# EAGLE design robotic_arm_arduino_uno_shield_ece196 (EAGLE 9.1.3)
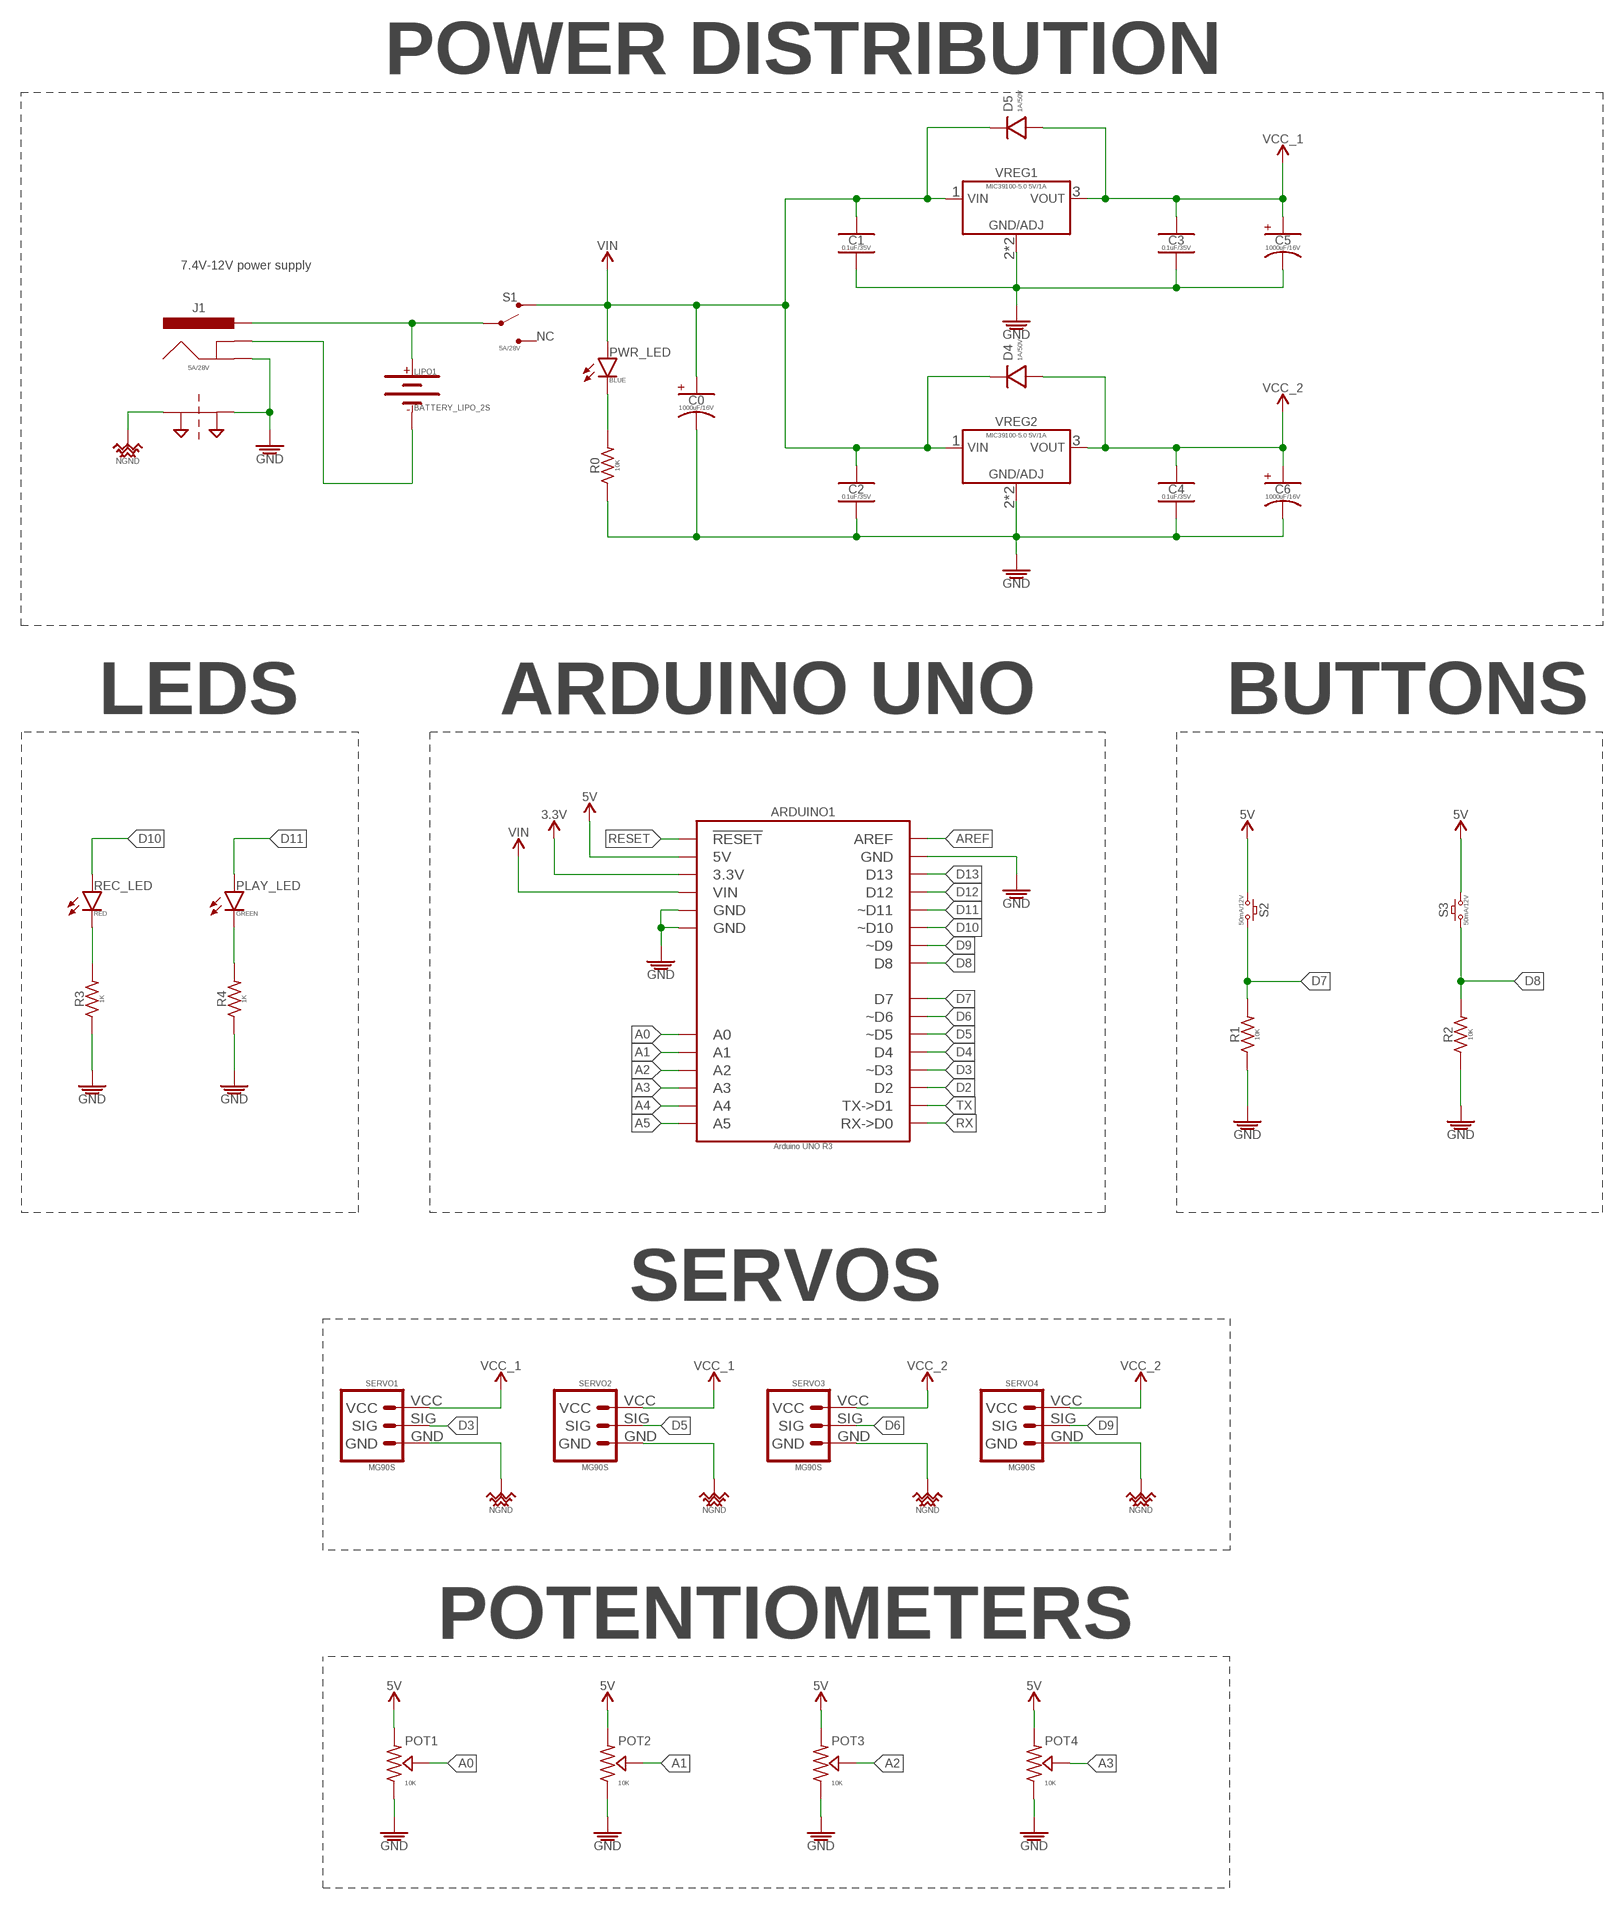
[diagram p0: schematic, sheet 1]

## Parts
ARDUINO1  Arduino UNO R3  ARDUINO_UNO_R3_NO-HOLES_NO-AVR-ISP_NO-I2C_NO-NC_NO-IOREF  [ARDUINO_UNO_R3_NO-HOLES_NO-AVR-ISP_NO-I2C_NO-NC_NO-IOREF]
C0  1000uF/16V  1000UF-POLARIZED_PTH_16V-20%  [_AE_PTH_DIA8-LS3.5-H21.50]
C1  0.1uF/35V  0.1UF_SMD-0805_35V-10%  [CAPC2012X95_SMD-0805]
C2  0.1uF/35V  0.1UF_SMD-0805_35V-10%  [CAPC2012X95_SMD-0805]
C3  0.1uF/35V  0.1UF_SMD-0805_35V-10%  [CAPC2012X95_SMD-0805]
C4  0.1uF/35V  0.1UF_SMD-0805_35V-10%  [CAPC2012X95_SMD-0805]
C5  1000uF/16V  1000UF-POLARIZED_PTH_16V-20%  [_AE_PTH_DIA8-LS3.5-H21.50]
C6  1000uF/16V  1000UF-POLARIZED_PTH_16V-20%  [_AE_PTH_DIA8-LS3.5-H21.50]
D4  1A/50V  DIODE_GENERAL-PURPOSE_SMD_GP_1A-50V  [SODFL3516X170]
D5  1A/50V  DIODE_GENERAL-PURPOSE_SMD_GP_1A-50V  [SODFL3516X170]
J1  5A/28V  POWER_JACK-BARREL_ID2.1MM-OD5.5MM_PTH_ID2.1MM-OD5.5MM  [POWER_JACK_PTH_ID2.1MM-OD5.5MM]
LIPO1  BATTERY_LIPO_2S  [DUAL_PTH_PADS]
PLAY_LED  GREEN  LED_SMD-0805_DISCRETE_GREEN  [LEDC2012X120_LED-0805]
POT1  10K  POTENTIOMETER_CONNECTOR_PTH_VERT_FEMALE_2.54MM  [HDRVR3W64P254_1X3_812X254X850B]
POT2  10K  POTENTIOMETER_CONNECTOR_PTH_VERT_FEMALE_2.54MM  [HDRVR3W64P254_1X3_812X254X850B]
POT3  10K  POTENTIOMETER_CONNECTOR_PTH_VERT_FEMALE_2.54MM  [HDRVR3W64P254_1X3_812X254X850B]
POT4  10K  POTENTIOMETER_CONNECTOR_PTH_VERT_FEMALE_2.54MM  [HDRVR3W64P254_1X3_812X254X850B]
PWR_LED  BLUE  LED_SMD-0805_DISCRETE_BLUE  [LEDC2012X120_LED-0805]
R0  10K  10KΩ_SMD-0805_1/8W-5%  [RESC2012X60_SMD-0805]
R1  10K  10KΩ_SMD-0805_1/8W-5%  [RESC2012X60_SMD-0805]
R2  10K  10KΩ_SMD-0805_1/8W-5%  [RESC2012X60_SMD-0805]
R3  1K  1KΩ_SMD-0805_1/8W-5%  [RESC2012X60_SMD-0805]
R4  1K  1KΩ_SMD-0805_1/8W-5%  [RESC2012X60_SMD-0805]
REC_LED  RED  LED_SMD-0805_DISCRETE_RED  [LEDC2012X120_LED-0805]
S1  5A/28V  SWITCH_SPDT_VERT_PTH_5A-28V_13L-7W_  [SW_TOGGLE_SPDT_5A-28V_13L-7W]
S2  50mA/12V  SWITCH_MOMENTARY_SPST_PTH_L12-W12-H7.2  [BTN_MOMENTARY_SPST-NO_PTH_L12-W12]
S3  50mA/12V  SWITCH_MOMENTARY_SPST_PTH_L12-W12-H7.2  [BTN_MOMENTARY_SPST-NO_PTH_L12-W12]
SERVO1  MG90S  SERVO_MG90S_PTH_VERT_FEMALE_2.54MM  [HDRVR3W64P254_1X3_812X254X850B]
SERVO2  MG90S  SERVO_MG90S_PTH_VERT_FEMALE_2.54MM  [HDRVR3W64P254_1X3_812X254X850B]
SERVO3  MG90S  SERVO_MG90S_PTH_VERT_FEMALE_2.54MM  [HDRVR3W64P254_1X3_812X254X850B]
SERVO4  MG90S  SERVO_MG90S_PTH_VERT_FEMALE_2.54MM  [HDRVR3W64P254_1X3_812X254X850B]
SUPPLY14  NET_BRIDGE  [NET_BRIDGE]
VREG1  MIC39100-5.0 5V/1A  MIC39100-XX_MIC39100-5.0_1A  [SOT229P700X180-4]
VREG2  MIC39100-5.0 5V/1A  MIC39100-XX_MIC39100-5.0_1A  [SOT229P700X180-4]

## Nets
3.3V: ARDUINO1.3.3V
5V: ARDUINO1.5V POT1.CCW POT2.CCW POT3.CCW POT4.CCW S2.1 S3.3
+: J1.PWR LIPO1.+ S1.P
-: J1.GND_BATTERY LIPO1.-
A0: ARDUINO1.A0 POT1.S
A1: ARDUINO1.A1 POT2.S
A2: ARDUINO1.A2 POT3.S
A3: ARDUINO1.A3 POT4.S
A4: ARDUINO1.A4
A5: ARDUINO1.A5
AREF: ARDUINO1.AREF
D2: ARDUINO1.D2
D3: ARDUINO1.D3(~D3) SERVO1.SIG
D4: ARDUINO1.D4
D5: ARDUINO1.D5(~D5) SERVO2.SIG
D6: ARDUINO1.D6(~D6) SERVO3.SIG
D7: ARDUINO1.D7 R1.2 S2.3
D8: ARDUINO1.D8 R2.2 S3.1
D9: ARDUINO1.D9(~D9) SERVO4.SIG
D10: ARDUINO1.D10(~D10) REC_LED.A
D11: ARDUINO1.D11(~D11) PLAY_LED.A
D12: ARDUINO1.D12
D13: ARDUINO1.D13
GND: ARDUINO1.GND@1(GND) ARDUINO1.GND@2(GND) ARDUINO1.GND@3(GND) C0.-(K) C1.2 C2.2 C3.2 C4.2 C5.-(K) C6.-(K) J1.GND_JACK POT1.CW POT2.CW POT3.CW POT4.CW R0.1 R1.1 R2.1 R3.1 R4.1 SUPPLY14.P$2 VREG1.2(GND) VREG1.TAB(GND) VREG2.2(GND) VREG2.TAB(GND)
N$1: PLAY_LED.K R4.2
N$2: R3.2 REC_LED.K
N$4: PWR_LED.K R0.2
NGND: SERVO1.GND SERVO2.GND SERVO3.GND SERVO4.GND SUPPLY14.P$1
RESET: ARDUINO1.RESET@1(!RESET!)
RX: ARDUINO1.D0(RX->D0)
TX: ARDUINO1.D1(TX->D1)
VCC_1: C3.1 C5.+(A) D5.A SERVO1.VCC SERVO2.VCC VREG1.3(VO)
VCC_2: C4.1 C6.+(A) D4.A SERVO3.VCC SERVO4.VCC VREG2.3(VO)
VIN: ARDUINO1.VIN C0.+(A) C1.1 C2.1 D4.K D5.K PWR_LED.A S1.S1 VREG1.1(VI) VREG2.1(VI)
Unconnected: S1.S2

## Notes on the sheet
- POWER DISTRIBUTION
- 7.4V-12V power supply
- NC
- LEDS | ARDUINO UNO | BUTTONS
- SERVOS
- POTENTIOMETERS

## Library data of the parts
ARDUINO1 = PiB_boards:ARDUINO_UNO_R3_NO-HOLES_NO-AVR-ISP_NO-I2C_NO-NC_NO-IOREF; DATASHEET: https://media.digikey.com/pdf/Data%20Sheets/Arduino%20PDFs/A000066_Web.pdf; DATASHEET_CABLE: http://www.assmann-wsw.com/fileadmin/datasheets/ASS_7066_CA.pdf; DATASHEET_CONNECTOR: http://www.sullinscorp.com/drawings/77____C___S___N-OMIT,_M500,_STRAIGHT,_C10436.pdf; DIST: Digikey; DISTLINK: https://www.digikey.com/products/en?keywords=1050-1024-ND; DISTLINK_CABLE: https://www.digikey.com/products/en?keywords=AE1462-ND; DISTLINK_CONNECTOR1: https://www.digikey.com/products/en?keywords=S1012E-06-ND; DISTLINK_CONNECTOR2: https://www.digikey.com/products/en?keywords=PEC08SAAN; DISTPN: 1050-1024-ND; DISTPN_CABLE: AE1462-ND; DISTPN_CONNECTOR1: S1012E-06-ND; DISTPN_CONNECTOR2: S1012E-08-ND; DIST_CABLE: Digikey; DIST_CONNECTOR: Digikey; MFR: Arduino; MFR_CABLE: Assmann WSW Components; MFR_CONNECTOR: Sullins Connector Solutions; MPN: A000066; MPN_CABLE: AK672/2-1; MPN_CONNECTOR1: PEC06SAAN; MPN_CONNECTOR2: PEC08SAAN; QTY_CONNECTOR1: 2; QTY_CONNECTOR2: 2
C0 C5 C6 = PiB_capacitors:1000UF-POLARIZED; DATASHEET: http://www.chemi-con.co.jp/cgi-bin/CAT_DB/SEARCH/cat_db_al.cgi?e=e&j=p&pdfname=kzm; DIST: Digikey; DISTLINK: https://www.digikey.com/products/en?keywords=565-3567-ND; DISTPN: 565-3567-ND; MFR: United Chemi-Con; MPN: EKZM160ELL102MH20D
C1-C4 = PiB_capacitors:0.1UF; DATASHEET: http://ds.yuden.co.jp/TYCOMPAS/ut/detail.do?productNo=GMK212BJ104KGHT&fileName=GMK212BJ104KGHT_SS&mode=specSheetDownload; DIST: Digikey; DISTLINK: https://www.digikey.com/products/en?keywords=587-3364-1-ND; DISTPN: 587-3364-1-ND; MFR: Taiyo Yuden; MPN: GMK212BJ104KGHT
D4 D5 = PiB_discrete_semiconductors:DIODE_GENERAL-PURPOSE; DATASHEET: http://www.comchiptech.com/cms/UserFiles/CGRKM4001-HF%20Thru.%20CGRKM4007-HF%20RevG.pdf; DIST: Digikey; DISTLINK: https://www.digikey.com/products/en?keywords=641-1511-1-ND; DISTPN: 641-1511-1-ND; MFR: Comchip Technology; MPN: CGRKM4001-HF
J1 = PiB_connectors:POWER_JACK-BARREL_ID2.1MM-OD5.5MM; DATASHEET: https://www.cui.com/product/resource/pj-102a.pdf; DIST: Digikey; DISTLINK: https://www.digikey.com/products/en?keywords=CP-102A-ND; DISTPN: CP-102A-ND; MFR: CUI Inc.; MPN: PJ-102A
LIPO1 = PiB_batteries:BATTERY_LIPO_2S
PLAY_LED = PiB_leds:LED; DATASHEET: http://optoelectronics.liteon.com/upload/download/DS22-2000-073/LTST-C170KGKT.pdf; DIST: Digikey; DISTLINK: https://www.digikey.com/products/en?keywords=160-1414-1-ND; DISTPN: 160-1414-1-ND; MFR: Lite-On Inc.; MPN: LTST-C170KGKT
POT1-POT4 = PiB_resistors:POTENTIOMETER; DATASHEET: http://www.ttelectronics.com/sites/default/files/download-files/Datasheet_RotaryPanelPot_P160series.pdf; DATASHEET_CONNECTOR: https://drawings-pdf.s3.amazonaws.com/10492.pdf; DIST: Digikey; DISTLINK: https://www.digikey.com/products/en?keywords=987-1715-ND; DISTLINK_CONNECTOR: https://www.digikey.com/products/en?keywords=PPTC031LFBN-RC; DISTPN: 987-1715-ND; DISTPN_CONNECTOR: S7001-ND; DIST_CONNECTOR: Digikey; MFR: TT Electronics/BI; MFR_CONNECTOR: Sullins Connector Solutions; MPN: P160KN2-0QA25B10K; MPN_CONNECTOR: PPTC031LFBN-RC
PWR_LED = PiB_leds:LED; DATASHEET: http://optoelectronics.liteon.com/upload/download/DS-22-99-0226/LTST-C170TBKT.pdf; DIST: Digikey; DISTLINK: https://www.digikey.com/products/en?keywords=160-1579-1-ND; DISTPN: 160-1579-1-ND; MFR: Lite-On Inc.; MPN: LTST-C170TBKT
R0 R1 R2 = PiB_resistors:10KΩ; DATASHEET: http://www.yageo.com/documents/recent/PYu-RC_Group_51_RoHS_L_9.pdf; DIST: Digikey; DISTLINK: https://www.digikey.com/products/en?keywords=311-10KARCT-ND; DISTPN: 311-10KARCT-ND; MFR: Yageo; MPN: RC0805JR-0710KL
R3 R4 = PiB_resistors:1KΩ; DATASHEET: http://www.yageo.com/documents/recent/PYu-RC_Group_51_RoHS_L_9.pdf; DIST: Digikey; DISTLINK: https://www.digikey.com/products/en?keywords=311-1.0KARCT-ND; DISTPN: 311-1.0KARCT-ND; MFR: Yageo; MPN: RC0805JR-071KL
REC_LED = PiB_leds:LED; DATASHEET: http://optoelectronics.liteon.com/upload/download/DS-22-99-0150/LTST-C170KRKT.pdf; DIST: Digikey; DISTLINK: https://www.digikey.com/products/en?keywords=160-1415-1-ND; DISTPN: 160-1415-1-ND; MFR: Lite-On Inc.; MPN: LTST-C170KRKT
S1 = PiB_switches:SWITCH_SPDT; DATASHEET: http://spec_sheets.e-switch.com/specs/T111597.pdf; DIST: Digikey; DISTLINK: https://www.digikey.com/products/en?keywords=EG2355-ND; DISTPN: EG2355-ND; MFR: E-Switch; MPN: 100SP1T1B4M2QE
S2 S3 = PiB_switches:SWITCH_MOMENTARY; DATASHEET: https://www.sparkfun.com/datasheets/Components/Buttons/TSA12110%20TACT%20SWITCH.jpg; DIST: Digikey; DISTLINK: https://www.digikey.com/products/en?keywords=1568-1332-ND; DISTPN: 1568-1332-ND; MFR: SparkFun Electronics; MPN: COM-10302
SERVO1-SERVO4 = PiB_motors:SERVO; DATASHEET: N/A; DATASHEET_CONNECTOR: https://drawings-pdf.s3.amazonaws.com/10492.pdf; DIST: Amazon; DISTLINK: https://www.amazon.com/RioRand-MG90S-Metal-Geared-Helicopter/dp/B00M8SR0ZK/ref=sr_1_1?s=toys-and-games&ie=UTF8&qid=1472114876&sr=1-1&keywords=MG90s+Micro+Metal+Geared+Servo; DISTLINK_CONNECTOR: https://www.digikey.com/products/en?keywords=PPTC031LFBN-RC; DISTPN: B00M8SR0ZK; DISTPN_CONNECTOR: S7001-ND; DIST_CONNECTOR: Digikey; MFR: TowerPro; MFR_CONNECTOR: Sullins Connector Solutions; MPN: MG90S; MPN_CONNECTOR: PPTC031LFBN-RC
SUPPLY14 = PiB_power_symbols:NET_BRIDGE
VREG1 VREG2 = PiB_ic_power:MIC39100-XX; DATASHEET: http://ww1.microchip.com/downloads/en/DeviceDoc/20005834A.pdf; DIST: Digikey; DISTLINK: https://www.digikey.com/products/en?keywords=576-1173-ND; DISTPN: 576-1173-ND; MFR: Microchip Technology; MPN: MIC39100-5.0WS

## Net classes
1 power: width 0.254 mm

## Board
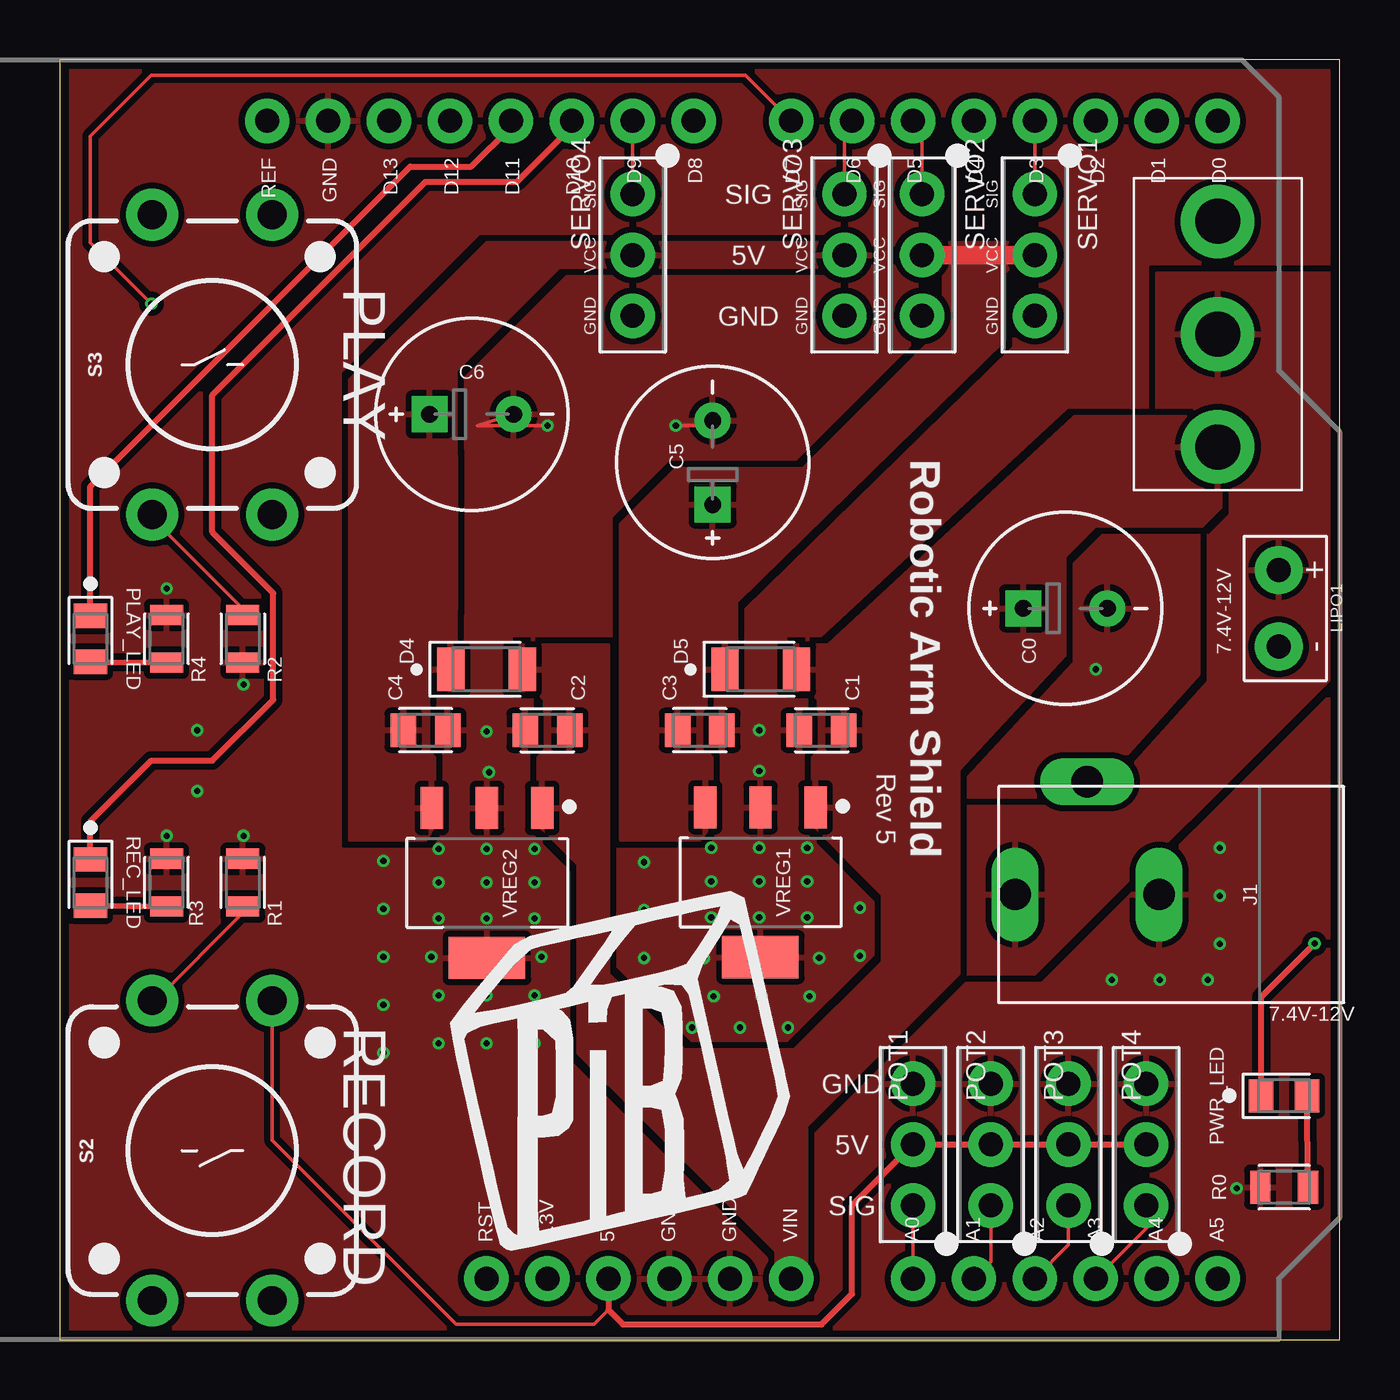
[diagram p1: board, top side]
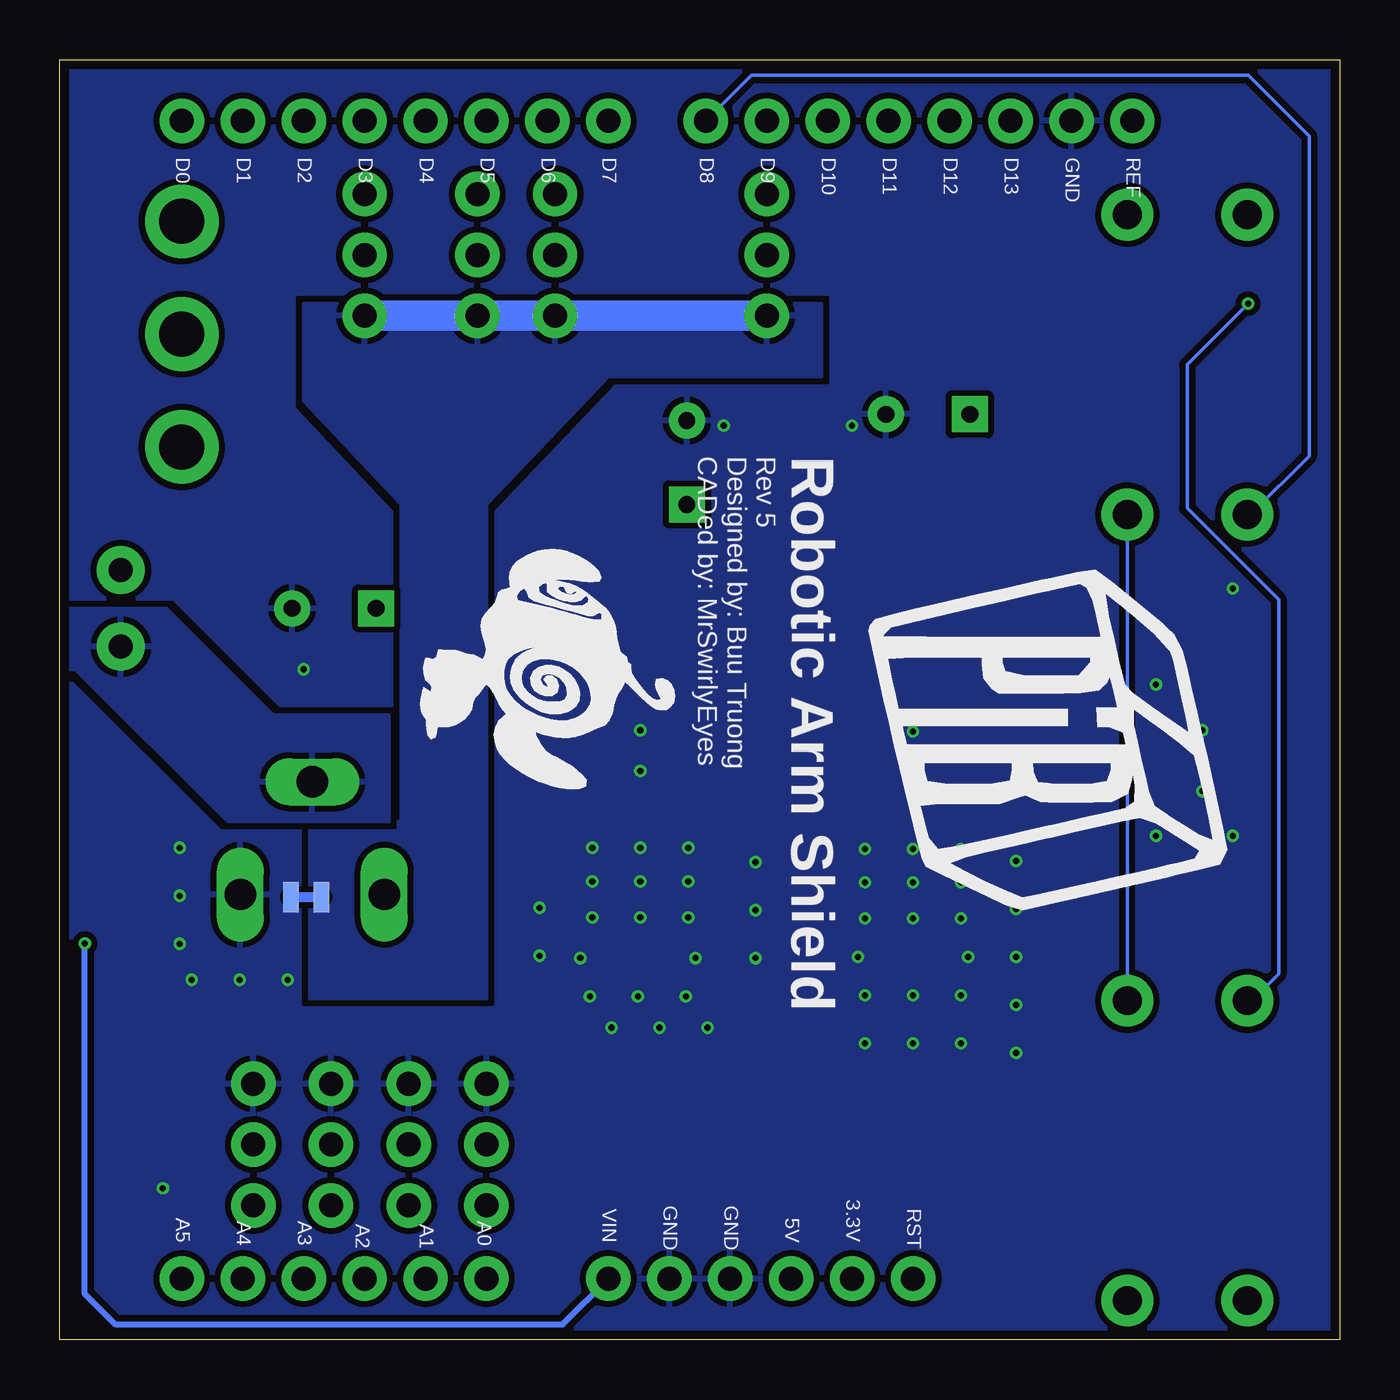
[diagram p2: board, bottom side, seen from below]

Size 53.34 x 53.34 mm. Coordinates in mm from the lower left corner, seen from the top.
Outline: 0,53.34 0,0 53.34,0 53.34,53.34 0,53.34
Copper layers (1*16): Top 0.035559375mm / dielectric 1.6mm / Bottom 0.035559375mm
Design rules "oshpark-2layer": minimum track width 6mil, minimum drill 10mil, track to track 6mil, track to pad 6mil, pad to pad 6mil, via to via 6mil, smd to smd 6mil, copper to edge 15mil, drill to drill 6mil, minimum pad ring 5mil, minimum via ring 5mil, stop-mask expansion 2.5mil, vias tented up to drill 0mil, thermal gap 10mil

### Footprints (pad centres in the part's own frame; a part is rotated, then mirrored left to right if it is on the bottom)
ARDUINO_UNO_R3_NO-HOLES_NO-AVR-ISP_NO-I2C_NO-NC_NO-IOREF = drill 1 pad 1.85: 3.3V 2.54,30.48; 5V 2.54,27.94; A0 2.54,15.24; A1 2.54,12.7; A2 2.54,10.16; A3 2.54,7.62; A4 2.54,5.08; A5 2.54,2.54; AREF 50.8,42.164; D0 50.8,2.54; D1 50.8,5.08; D2 50.8,7.62; D3 50.8,10.16; D4 50.8,12.7; D5 50.8,15.24; D6 50.8,17.78; D7 50.8,20.32; D8 50.8,24.384; D9 50.8,26.924; D10 50.8,29.464; D11 50.8,32.004; D12 50.8,34.544; D13 50.8,37.084; GND@1 2.54,25.4; GND@2 2.54,22.86; GND@3 50.8,39.624; RESET@1 2.54,33.02; VIN 2.54,20.32
_AE_PTH_DIA8-LS3.5-H21.50 = drill 0.7 pad 1.5 square: + -1.75,0 | drill 0.7 pad 1.5: - 1.75,0
CAPC2012X95_SMD-0805 = smd 1.065 x 1.379: 1 -0.925,0; 2 0.925,0
SODFL3516X170 = smd 1.136 x 1.815: A -1.489,0; K 1.489,0
POWER_JACK_PTH_ID2.1MM-OD5.5MM = drill 1.3 long: GND_BATTERY 4.7,0; GND_JACK 0,-3; PWR 0,3
DUAL_PTH_PADS = drill 1 pad 2: + -1.6,0; - 1.6,0
LEDC2012X120_LED-0805 = smd 1.01 x 1.379: A -0.96,0; K 0.96,0
HDRVR3W64P254_1X3_812X254X850B = drill 1 pad 1.85: CCW 2.54,0; CW 5.08,0; S 0,0
RESC2012X60_SMD-0805 = smd 0.838 x 1.379: 1 -0.995,0; 2 0.995,0
SW_TOGGLE_SPDT_5A-28V_13L-7W = drill 1.875 pad 3.075: P 0,0; S1 0,-4.7; S2 0,4.7
BTN_MOMENTARY_SPST-NO_PTH_L12-W12 = drill 1.2 pad 2.159: 1 6.25,-2.5; 2 -6.25,-2.5; 3 6.25,2.5; 4 -6.25,2.5
HDRVR3W64P254_1X3_812X254X850B' = drill 1 pad 1.85: GND 5.08,0; SIG 0,0; VCC 2.54,0
NET_BRIDGE = smd 0.635 x 1.27: P$1 -0.635,0; P$2 0.635,0
SOT229P700X180-4 = smd 1.76 x 0.932: 1 -3.125,2.3; 2 -3.125,0; 3 -3.125,-2.3 | smd 1.76 x 3.189: TAB 3.125,0

### Placement (x,y rotation side)
ARDUINO1  50.8,0 90 top
C0  41.91,30.48 0 top
C1  31.75,25.4 180 top
C2  20.32,25.4 180 top
C3  26.67,25.4 0 top
C4  15.24,25.4 0 top
C5  27.21,36.56 90 top
C6  17.16,38.57 0 top
D4  17.78,27.94 0 top
D5  29.21,27.94 0 top
J1  42.82,18.55 90 top
LIPO1  50.8,30.48 270 top
PLAY_LED  1.27,29.21 270 top
POT1  35.56,5.59 90 top
POT2  38.8,5.59 90 top
POT3  42.04,5.59 90 top
POT4  45.28,5.59 90 top
PWR_LED  51.03,10.16 0 top
R0  51.03,6.35 0 top
R1  7.62,19.05 270 top
R2  7.62,29.21 90 top
R3  4.44,19.05 270 top
R4  4.44,29.21 270 top
REC_LED  1.27,19.05 270 top
S1  48.26,41.91 0 top
S2  6.35,7.87 90 top
S3  6.35,40.64 270 top
SERVO1  MG90S  [HDRVR3W64P254_1X3_812X254X850B']  40.64,47.75 270 top
SERVO2  MG90S  [HDRVR3W64P254_1X3_812X254X850B']  35.94,47.75 270 top
SERVO3  MG90S  [HDRVR3W64P254_1X3_812X254X850B']  32.7,47.75 270 top
SERVO4  MG90S  [HDRVR3W64P254_1X3_812X254X850B']  23.88,47.75 270 top
SUPPLY14  43.08,18.43 180 bottom
U$2  [MRSWIRLYEYES-LOGO]  33.02,27.94 270 bottom
U$3  [PIB_LOGO_5MM]  12.15,25 270 bottom
U$4  [PIB_LOGO_5MM]  23.35,11.2 0 top
VREG1  29.2,19.06 270 top
VREG2  17.8,19.03 270 top

### Tracks (layer width: path | path; a pad name or v marks a point on that pad's centre or on a via)
5V
  Top 0.152: S2.1 8.85,8.29 16.51,0.64 22.25,0.64 22.86,1.24
  Top 0.254: POT4.CCW POT3.CCW POT2.CCW POT1.CCW 33.02,5.59 33.02,1.91 31.75,0.64 23.46,0.64 22.86,1.24 ARDUINO1.5V
  Bottom 0.152: S2.1 S3.3
+
  pour Top (isolate 0.254, rank 2): 45.72,44.45 45.72,38.48 47.88,38.48 47.88,27.43 43.18,22.23 37.46,22.23 37.46,15.24 40.64,15.24 53.34,27.94 53.34,44.45
-
  pour Bottom: 48.9,30.48 44.45,26.04 39.62,26.04 39.62,21.59 46.36,21.59 52.7,27.94 53.34,27.94 53.34,30.48
A0
  Top 0.152: POT1.S ARDUINO1.A0
A1
  Top 0.152: POT2.S 38.8,3.24 ARDUINO1.A1
A2
  Top 0.152: POT3.S 42.04,3.94 ARDUINO1.A2
A3
  Top 0.152: POT4.S 45.28,4.64 ARDUINO1.A3
D3
  Top 0.152: SERVO1.SIG ARDUINO1.D3
D5
  Top 0.152: SERVO2.SIG 35.94,50.42 ARDUINO1.D5
D6
  Top 0.152: SERVO3.SIG 32.7,50.48 ARDUINO1.D6
D7  (via drill 0.25)
  Top 0.152: R1.2 7.62,17.78 3.96,14.12 S2.3 | ARDUINO1.D7 28.58,52.7 3.81,52.7 1.27,50.16 1.27,45.72 v3.81,43.18
  Bottom 0.152: v3.81,43.18 6.35,40.64 6.35,34.66 2.54,30.84 2.54,15.24 3.66,14.12 S2.3
D8
  Top 0.152: S3.1 3.85,34.25 7.62,30.48 R2.2
  Bottom 0.152: ARDUINO1.D8 24.51,52.7 3.81,52.7 1.27,50.16 1.27,36.83 3.71,34.39 S3.1
D9
  Top 0.152: SERVO4.SIG ARDUINO1.D9
D10
  Top 0.254: ARDUINO1.D10 21.34,50.55 19.05,48.26 15.24,48.26 6.35,39.37 6.35,33.66 8.89,31.11 8.89,26.67 6.35,24.13 3.81,24.13 1.27,21.59 REC_LED.A
D11
  Top 0.254: PLAY_LED.A 1.27,35.56 14.61,48.9 17.14,48.9 18.8,50.55 ARDUINO1.D11
GND  (via drill 0.25)
  Top 0.152: C6.- 17.42,38.1 v20.32,38.1 | C5.- 27.18,38.1 v25.67,38.1
  Bottom 0.152: v5.71,25.4 v5.71,22.86
  other vias: 17.78,19.05 43.18,27.94 29.15,17.6 29.25,14.3 31.65,15.9 26.85,15.9 29.15,20.5 29.15,19.1 24.35,19.9 26.35,13 30.35,13 28.35,13 33.35,16 33.35,18 27.15,17.6 31.15,17.6 27.15,19.1 31.15,19.1 29.15,23.7 24.35,17.9 24.35,15.9 31.15,20.5 27.15,20.5 19.78,19.05 15.78,19.05 17.78,17.55 19.78,17.55 15.78,17.55 17.78,20.45 19.78,20.45 15.78,20.45 17.78,14.35 20.08,15.95 15.48,15.95 17.78,12.35 19.78,12.35 15.78,12.35 15.78,14.35 19.78,14.35 27.25,14.3 31.25,14.3 13.48,15.95 13.48,13.95 13.48,11.95 13.48,17.95 13.48,19.95 17.88,23.65 17.78,25.35 29.15,25.4 4.45,21 7.65,21 4.45,31.3 7.65,27.3 49.05,6.3 48.35,18.5 45.85,15 43.85,15 48.35,16.5 47.85,15 48.35,20.5
  pour Bottom (isolate 0.254, rank 3): 53.34,53.34 53.34,0 0,0 0,53.34
  pour Top (isolate 0.254, rank 3): 53.34,53.34 53.34,0 0,0 0,53.34
N$1
  Top 0.254: PLAY_LED.K R4.2
N$2
  Top 0.254: REC_LED.K R3.2
N$4
  Top 0.254: R0.2 PWR_LED.K
NGND
  Bottom 1.27: SERVO1.GND SERVO2.GND SERVO3.GND SERVO4.GND
  pour Bottom (isolate 0.254, rank 2): 21.59,43.18 21.59,40.13 30.48,40.13 35.56,34.8 35.56,14.22 42.93,14.22 42.93,21.59 39.12,21.59 39.12,34.8 43.18,39.12 43.18,43.18
VCC_1
  Top 0.762: SERVO2.VCC SERVO1.VCC
  pour Top (isolate 0.254): 35.05,45.72 35.05,44.7 36.58,44.7 36.83,44.45 36.83,42.16 30.97,36.31 25.69,36.31 23.37,33.99 23.37,20.83 26.67,20.83 27.18,21.46 27.18,24.26 26.92,24.51 26.92,27.18 28.19,27.18 28.19,30.73 39.37,41.66 39.37,44.45 39.62,44.7 41.15,44.7 41.15,45.72
VCC_2
  pour Top: 33.78,45.72 17.78,45.72 12.06,40.01 12.06,20.83 15.24,20.83 15.62,21.46 15.62,24.26 15.37,24.51 15.37,27.05 16.51,27.05 16.51,30.48 16.53,30.48 16.53,36.81 16.51,36.83 16.51,40.39 20.83,44.7 33.78,44.7
VIN  (via drill 0.25)
  Top 0.254: PWR_LED.A 50.07,14.28 v52.3,16.51
  Bottom 0.254: v52.3,16.51 52.3,1.91 51.03,0.64 32.38,0.64 ARDUINO1.VIN
  pour Top (isolate 0.254): 48.39,38.48 42.29,38.48 32.02,28.96 30.23,28.96 30.23,27.05 31.24,27.05 31.62,26.67 31.62,24.51 31.37,24.26 31.37,21.46 34.29,18.54 34.29,15.75 30.61,12.06 26.03,12.06 22.86,15.24 22.86,28.96 18.8,28.96 18.8,27.05 19.81,27.05 20.19,26.67 20.19,24.51 19.94,24.26 19.94,21.46 21.59,19.81 21.59,11.94 29.84,3.68 29.84,1.91 31.12,1.91 31.12,8.89 37.46,15.24 37.46,23.75 41.89,28.51 41.89,32.64 43.16,33.91 47.62,33.91 48.39,34.67

### Text on the board
tPlace: REF | GND | D13 | D12 | D11 | D10 | D9 | D8 | D7 | D6 | D5 | D4 | D3 | D2 | D1 | D0 | SIG | 5V | GND | PLAY | Robotic Arm Shield | 7.4V-12V | Rev 5 | 7.4V-12V | GND | RECORD | 5V | SIG | RST | 3.3V | 5V | GND | GND | VIN | A0 | A1 | A2 | A3 | A4 | A5
bPlace: REF | GND | D13 | D12 | D11 | D10 | D9 | D8 | D7 | D6 | D5 | D4 | D3 | D2 | D1 | D0 | Robotic Arm Shield | Rev 5 / Designed by: Buu Truong / CADed by: MrSwirlyEyes | 3.3V | GND | GND | RST | 5V | VIN | A0 | A1 | A2 | A3 | A4 | A5
tValues: 1A/50V | 1A/50V